# EasyEDA schematic SCH_DRV8701 on Boosted Supply_2023-01-10.json
TITLE: 用DRV8701绘制升压电机电路; REV: 1.0; Date: 2023-01-10; Sheet: 1/1; Drawn By: iiru; Company: Lanshan Studio
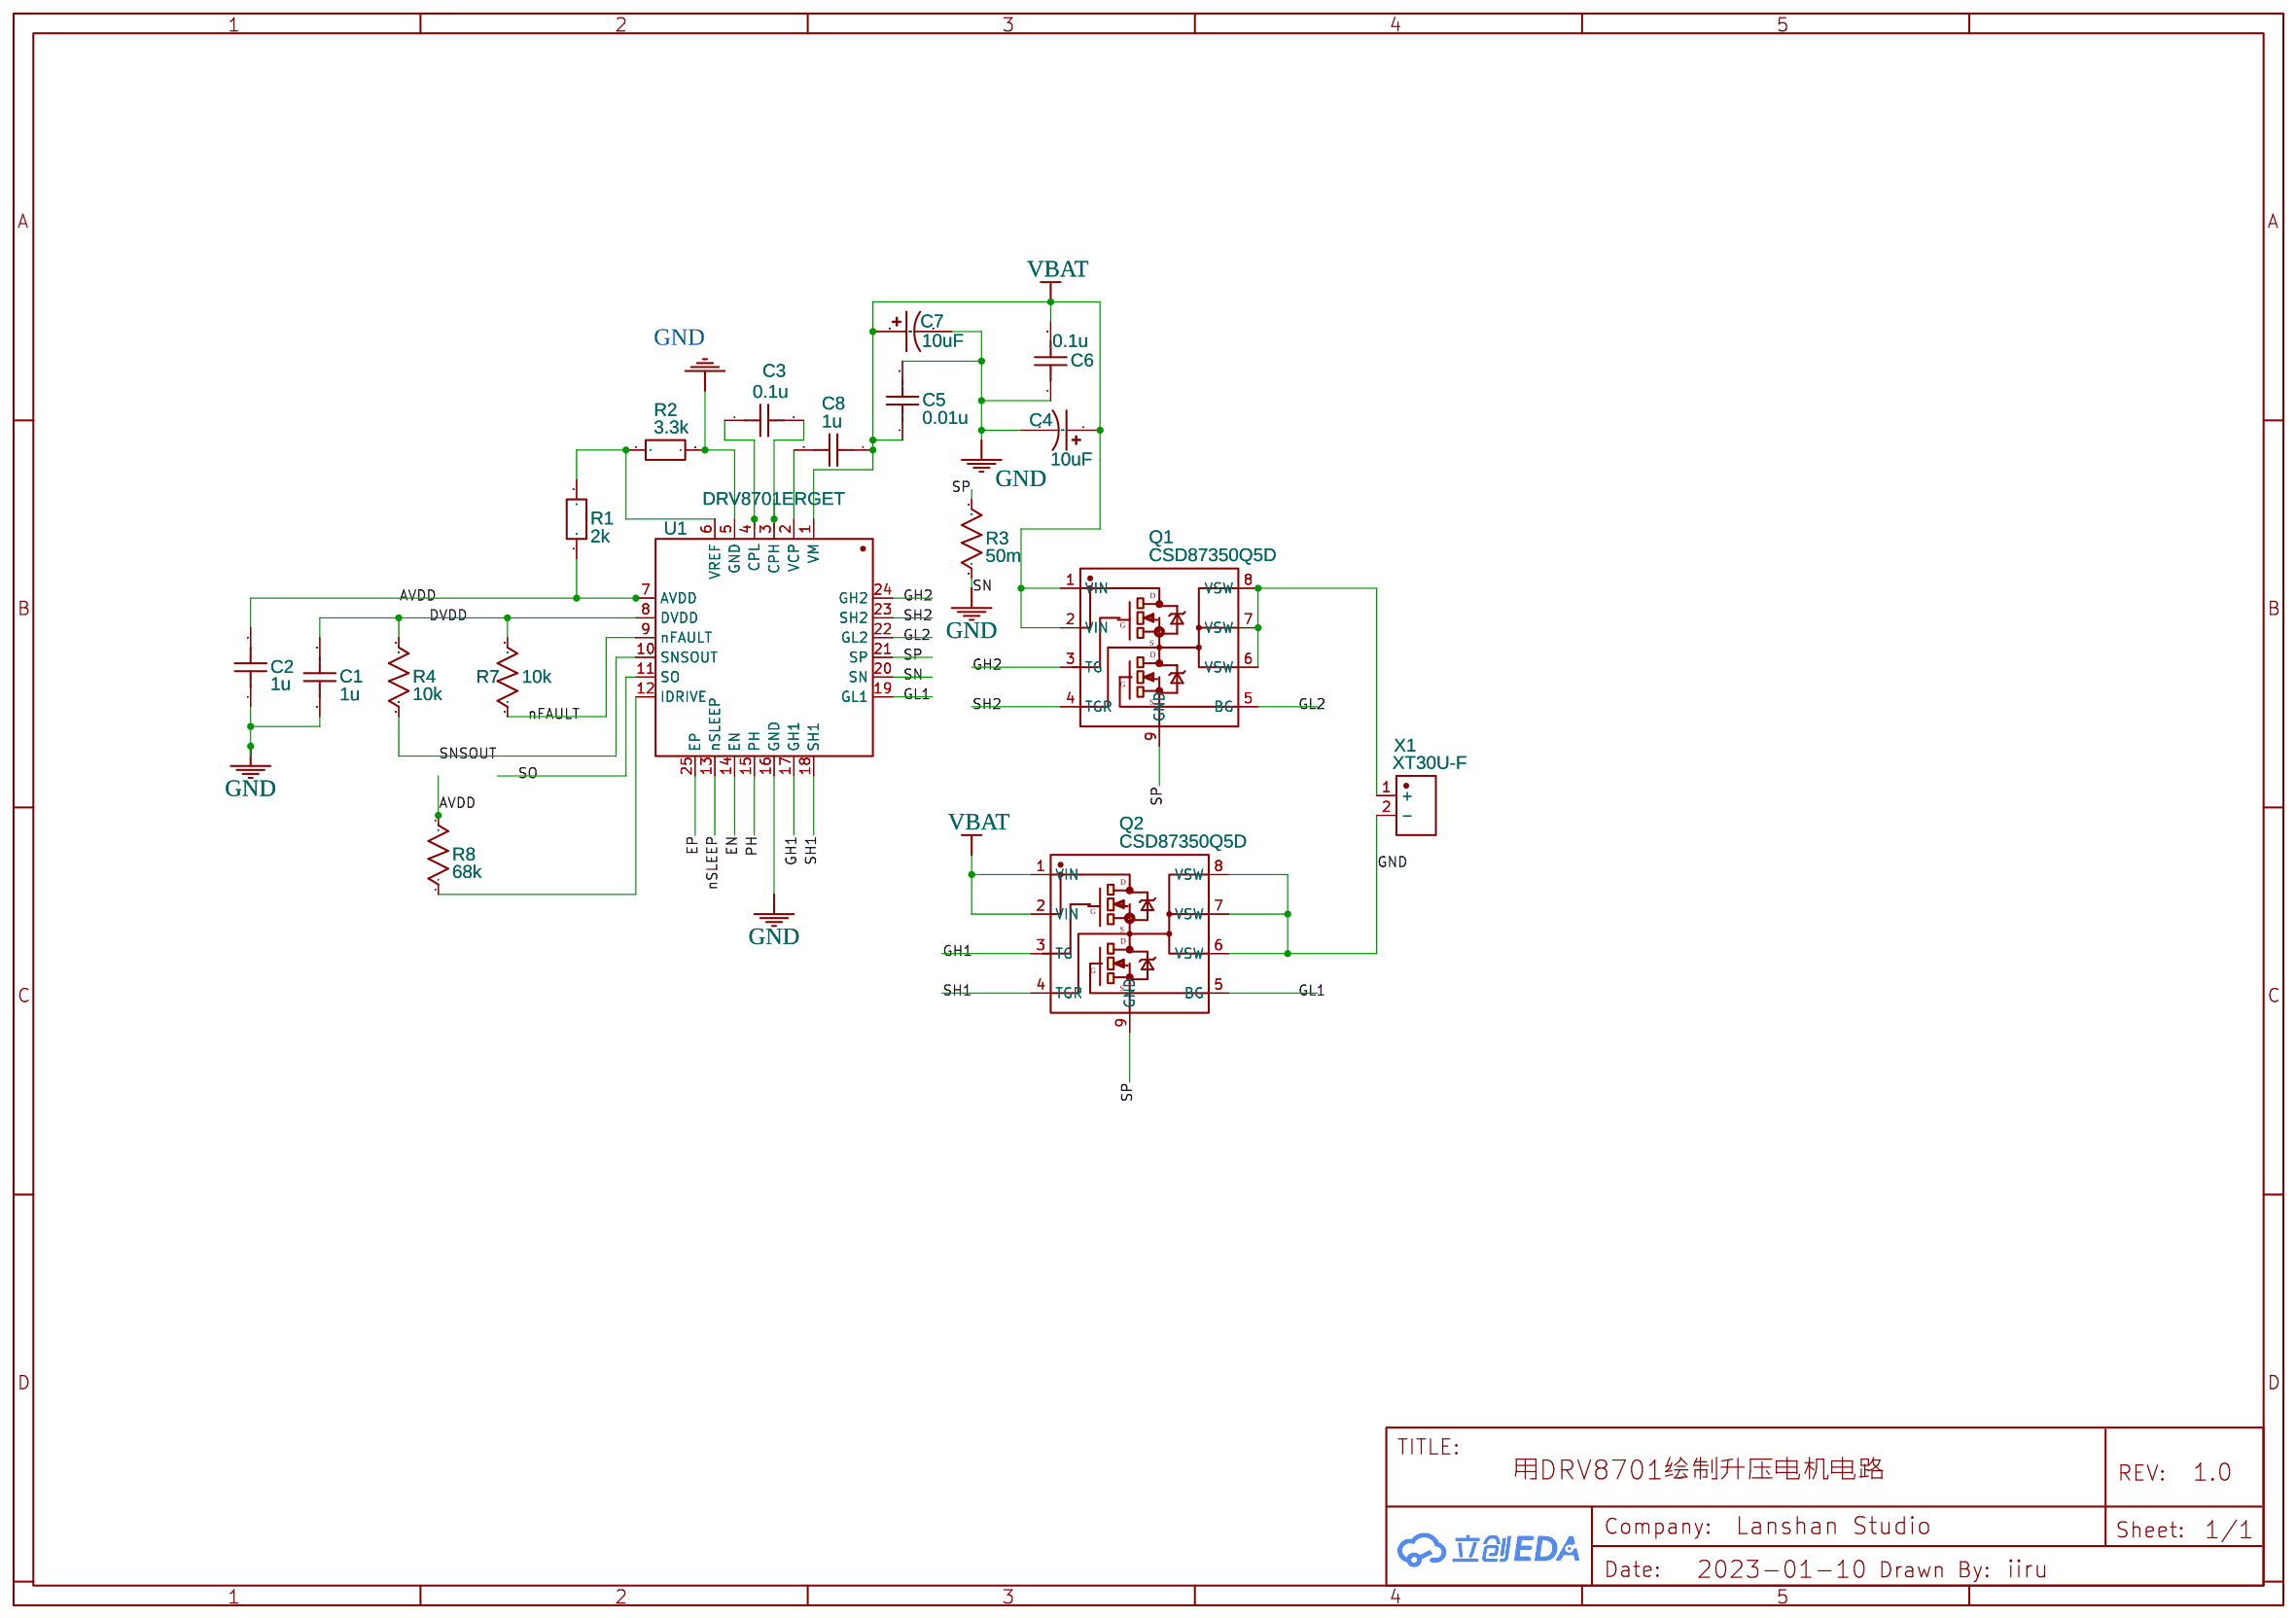
[diagram p0: schematic sheet]

## Parts
C1  1u  [C0603]
C2  1u  [C0603]
C3  0.1u  [C0603]
C4  10uF  [CASE-A_3216]
C5  0.01u  [C0603]
C6  0.1u  [C0603]
C7  10uF  [CASE-A_3216]
C8  1u  [C0603]
Q1  CSD87350Q5D  [LSON-8_L6.0-W5.0-P1.27-LS6.0-TL-EP]
Q2  CSD87350Q5D  [LSON-8_L6.0-W5.0-P1.27-LS6.0-TL-EP]
R1  2k  [R0603]
R2  3.3k  [R0603]
R3  50m  [R0603]
R4  10k  [R0603]
R7  10k  [R0603]
R8  68k  [R0603]
U1  DRV8701ERGET  [VQFN-24_L4.0-W4.0-P0.50-BL-EP2.5]
X1  XT30U-F  [XT30]

## Library data of the parts
C1-C3 C5 C6 C8 = C_0603_US: Contributor: LCEDA_Lib
C4 C7 = C_Tan_SMD_A_US: Contributor: LCEDA_Lib
Q1 Q2 = CSD87350Q5D: Supplier: LCSC; Supplier Part: C140356; Manufacturer: TI(德州仪器); Contributor: LCSC; JLCPCB Part Class: Extended Part
R1 R2 = R_0603_EU: Contributor: LCEDA_Lib
R3 R4 R7 R8 = R_0603_US: Contributor: LCEDA_Lib
U1 = DRV8701ERGET: Supplier: LCSC; Manufacturer: TI(德州仪器); Contributor: LCSC; Supplier Part: C132049; JLCPCB Part Class: Extended Part
X1 = XT30U-F: Manufacturer: AMASS(艾迈斯); Supplier Part: C99102; Supplier: LCSC; link: https://item.szlcsc.com/100315.html; Contributor: 彬_Linus

## Nets
AVDD: C2.2 R1.1 R8.2 U1.7(AVDD)
DVDD: C1.1 R4.2 R7.2 U1.8(DVDD)
GND: C1.2 C2.1 C4.2 C5.2 C6.1 C7.2 Q2.6(VSW) Q2.7(VSW) Q2.8(VSW) R2.2 R3.1 U1.5(GND) U1.16(GND) U1.20(SN) X1.2(-)
VBAT: C4.1 C5.1 C6.2 C7.1 C8.1 Q1.1(VIN) Q1.2(VIN) Q2.1(VIN) Q2.2(VIN) U1.1(VM)
EN: U1.14(EN)
EP: U1.25(EP)
GH1: Q2.3(TG) U1.17(GH1)
GH2: Q1.3(TG) U1.24(GH2)
GL1: Q2.5(BG) U1.19(GL1)
GL2: Q1.5(BG) U1.22(GL2)
nFAULT: R7.1 U1.9(nFAULT)
nSLEEP: U1.13(nSLEEP)
PH: U1.15(PH)
SH1: Q2.4(TGR) U1.18(SH1)
SH2: Q1.4(TGR) U1.23(SH2)
SNSOUT: R4.1 U1.10(SNSOUT)
SO: U1.11(SO)
SP: Q1.9(GND) Q2.9(GND) R3.2 U1.21(SP)
Net-(C3-1): C3.1 U1.4(CPL)
Net-(C3-2): C3.2 U1.3(CPH)
Net-(C8-2): C8.2 U1.2(VCP)
Net-(Q1-6): Q1.6(VSW) Q1.7(VSW) Q1.8(VSW) X1.1(+)
Net-(R1-2): R1.2 R2.1 U1.6(VREF)
Net-(R8-1): R8.1 U1.12(IDRIVE)
